# Altium project BalanceCar_PCB.PrjPcb
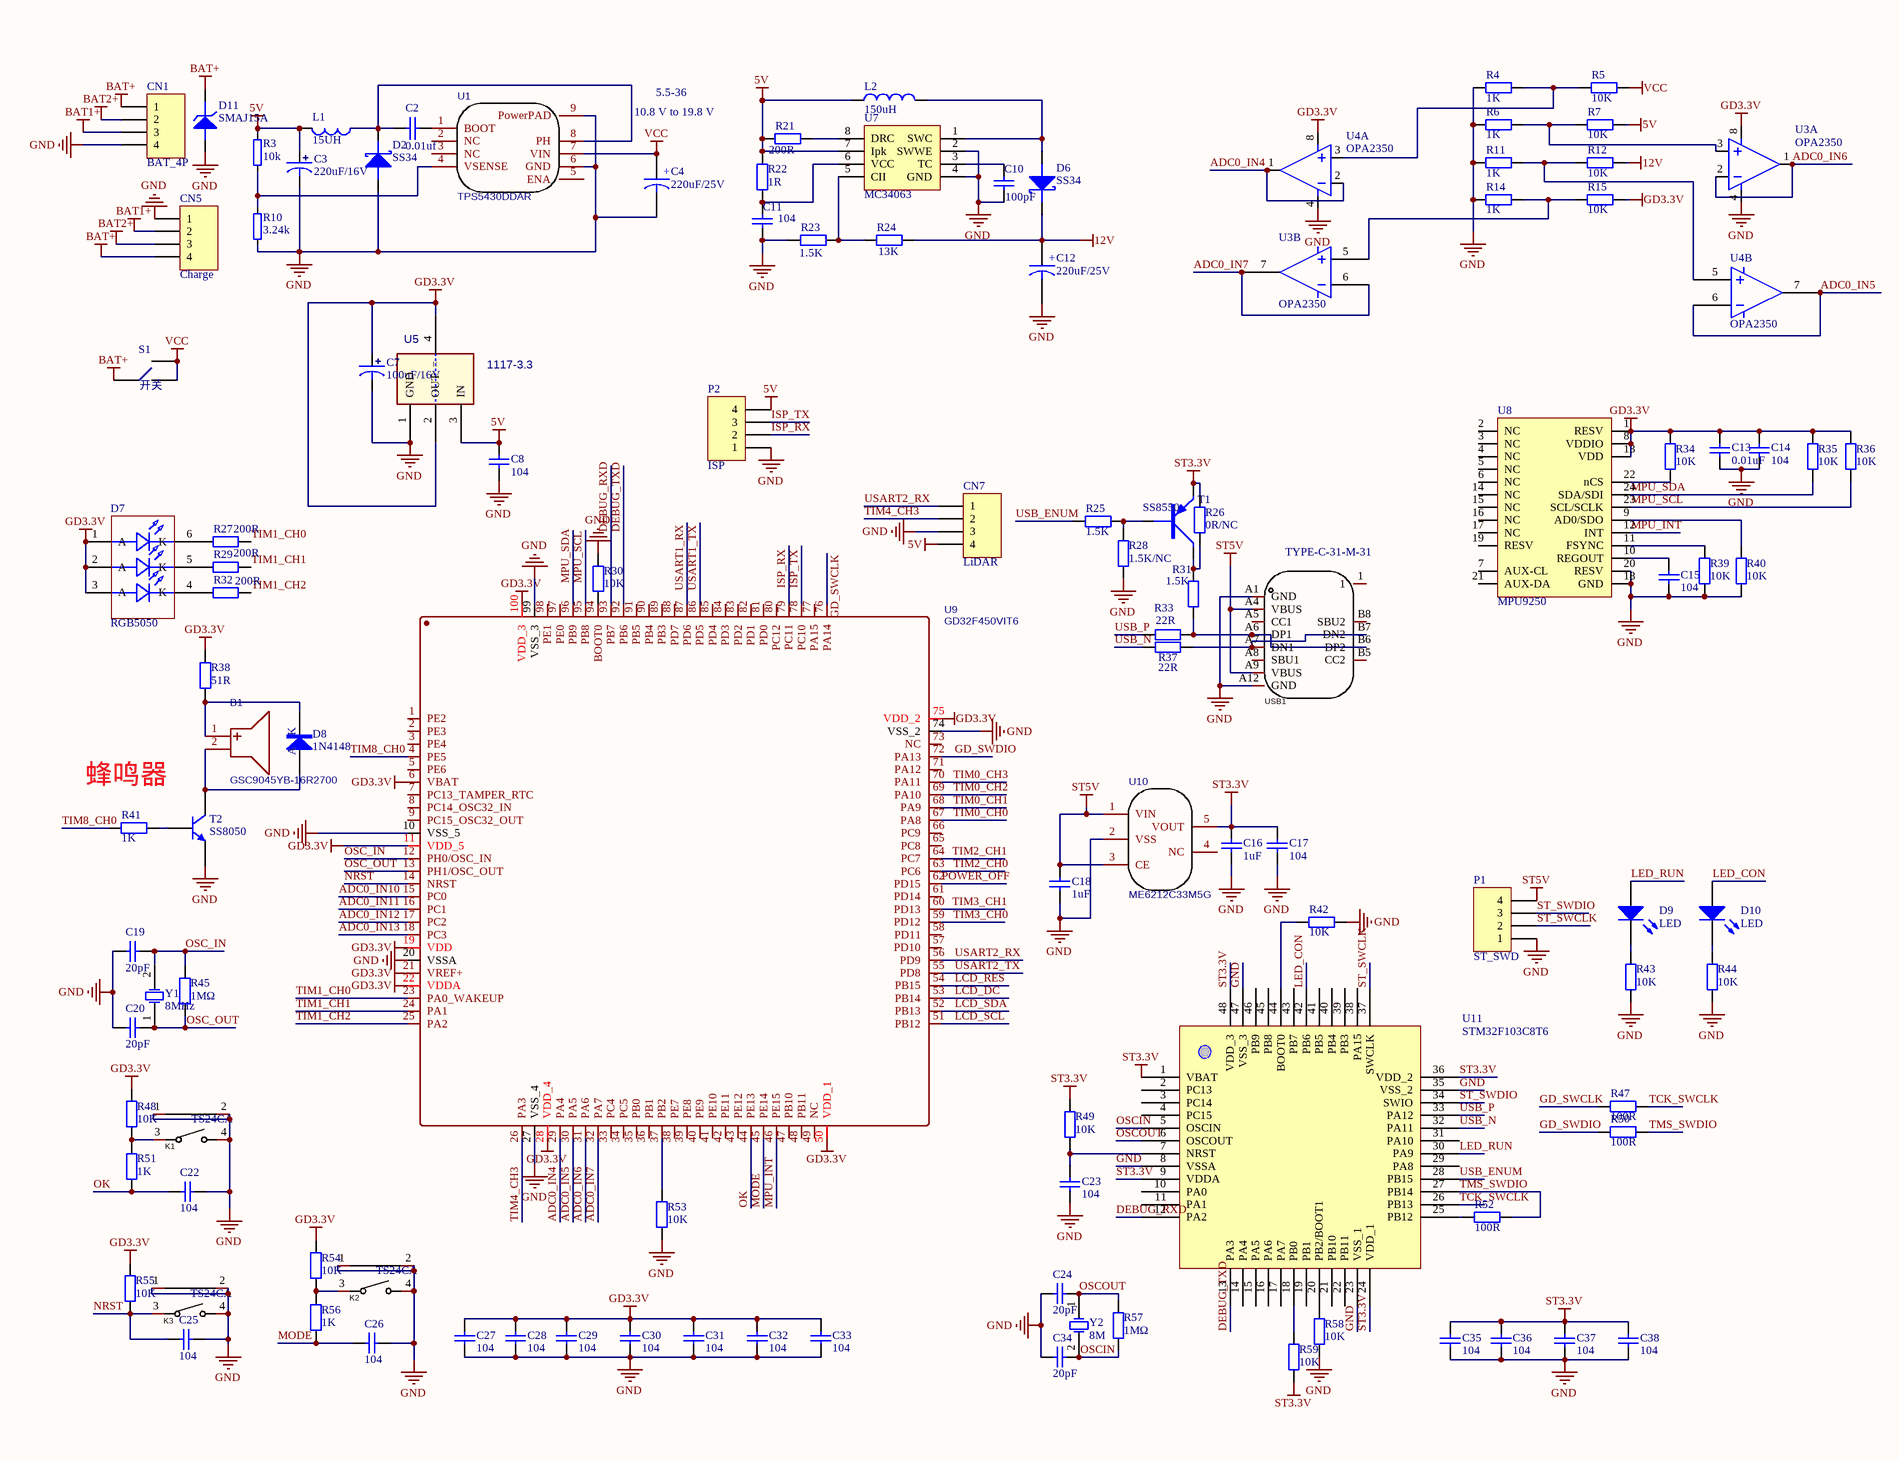
[diagram p0: BalanceCar_sch.SchDoc, left]
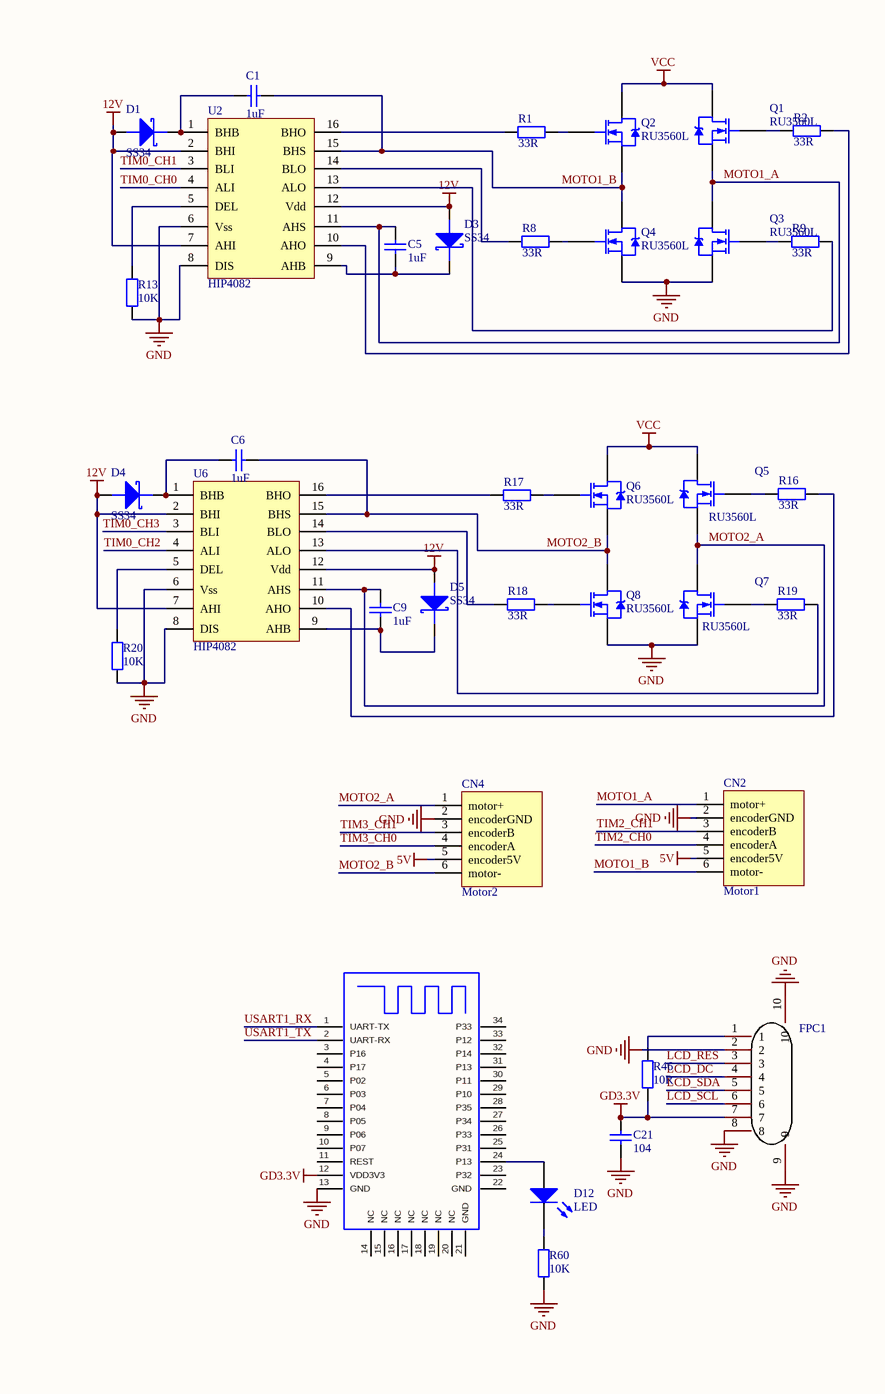
[diagram p1: BalanceCar_sch.SchDoc, right]
1 sheet, 150 parts. Net scope: global (net labels, ports and power ports of the same name join across sheets).
Board file: BalanceCar_pcb.PcbDoc

## Sheet BalanceCar_sch.SchDoc
size A2

### Parts
B1  GSC9045YB-16R2700  [BUZ-SMD_GSC9045YB-16R2700]
C1  1uF  [0603-JLC-C]
C2  0.01uf  [0603-JLC-C]
C3  220uF/16V  [SMD,6.3x5.3mm]
C4  220uF/25V  [SMD,6.3x5.8mm]
C5  1uF  [0603-JLC-C]
C6  1uF  [0603-JLC-C]
C7  100uF/16V  [SMD,6.3x5.3mm]
C8  104  [0603-JLC-C]
C9  1uF  [0603-JLC-C]
C10  100pF  [0603-JLC-C]
C11  104  [0603-JLC-C]
C12  220uF/25V  [SMD,6.3x5.8mm]
C13  0.01uF  [0603-JLC-C]
C14  104  [0603-JLC-C]
C15  104  [0603-JLC-C]
C16  1uF  [0603-JLC-C]
C17  104  [0603-JLC-C]
C18  1uF  [0603-JLC-C]
C19  20pF  [0603-JLC-C]
C20  20pF  [0603-JLC-C]
C21  104  [0603-JLC-C]
C22  104  [0603-JLC-C]
C23  104  [0603-JLC-C]
C24  20pF  [0603-JLC-C]
C25  104  [0603-JLC-C]
C26  104  [0603-JLC-C]
C27  104  [0603-JLC-C]
C28  104  [0603-JLC-C]
C29  104  [0603-JLC-C]
C30  104  [0603-JLC-C]
C31  104  [0603-JLC-C]
C32  104  [0603-JLC-C]
C33  104  [0603-JLC-C]
C34  20pF  [0603-JLC-C]
C35  104  [0603-JLC-C]
C36  104  [0603-JLC-C]
C37  104  [0603-JLC-C]
C38  104  [0603-JLC-C]
CN1  BAT_4P  [CONN-TH_4P-P2.50_HX25003-4A]
CN2  Motor1  [CONN-TH_6P-P2.50_X8821WR-06S-N2SN]
CN4  Motor2  [CONN-TH_6P-P2.50_X8821WR-06S-N2SN]
CN5  Charge  [CONN-TH_4P-P2.54_X8821WR-06S-N2SN]
CN7  LiDAR  [CONN-TH_4P-P2.50_HX25003-4A]
D1  SS34  [SMA(DO-214AC)]
D2  SS34  [SMA(DO-214AC)]
D3  SS34  [SMA(DO-214AC)]
D4  SS34  [SMA(DO-214AC)]
D5  SS34  [SMA(DO-214AC)]
D6  SS34  [SMA(DO-214AC)]
D7  RGB5050  [LED-SMD_6P-L5.0-W5.0-FD]
D8  1N4148  [1206]
D9  LED  [0603LED]
D10  LED  [0603LED]
D11  SMAJ15A  [SMA(DO-214AC)]
D12  LED  [0603LED]
FPC1  AFC24-S08FIC-00  [FPC-SMD_P0.50-8P-QCHF-SM-H2.0]  (value not drawn)
K1  TS24CA  [SW-SMD_TS24CA]
K2  TS24CA  [SW-SMD_TS24CA]
K3  TS24CA  [SW-SMD_TS24CA]
L1  15UH  [IND-SMD_L7.1-W6.6]
L2  150uH  [IND-SMD_L5.0-W5.0_SMNR5040]
P1  ST_SWD  [HDR1X4]
P2  ISP  [HDR1X4]
Q1  RU3560L  [TO-252-3L]
Q2  RU3560L  [TO-252-3L]
Q3  RU3560L  [TO-252-3L]
Q4  RU3560L  [TO-252-3L]
Q5  RU3560L  [TO-252-3L]
Q6  RU3560L  [TO-252-3L]
Q7  RU3560L  [TO-252-3L]
Q8  RU3560L  [TO-252-3L]
R1  33R  [0603-RMOS]
R2  33R  [0603-RMOS]
R3  10k  [0603-JLC-R]
R4  1K  [0603-JLC-R]
R5  10K  [0603-JLC-R]
R6  1K  [0603-JLC-R]
R7  10K  [0603-JLC-R]
R8  33R  [0603-RMOS]
R9  33R  [0603-RMOS]
R10  3.24k  [0603-JLC-R]
R11  1K  [0603-JLC-R]
R12  10K  [0603-JLC-R]
R13  10K  [0603-JLC-R]
R14  1K  [0603-JLC-R]
R15  10K  [0603-JLC-R]
R16  33R  [0603-RMOS]
R17  33R  [0603-RMOS]
R18  33R  [0603-RMOS]
R19  33R  [0603-RMOS]
R20  10K  [0603-JLC-R]
R21  200R  [0603-JLC-R]
R22  1R  [0603-JLC-R]
R23  1.5K  [0603-JLC-R]
R24  13K  [0603-JLC-R]
R25  1.5K  [0603-JLC-R]
R26  0R/NC  [0603-JLC-R]
R27  200R  [0603-JLC-R]
R28  1.5K/NC  [0603-JLC-R]
R29  200R  [0603-JLC-R]
R30  10K  [0603-JLC-R]
R31  1.5K  [0603-JLC-R]
R32  200R  [0603-JLC-R]
R33  22R  [0603-JLC-R]
R34  10K  [0603-JLC-R]
R35  10K  [0603-JLC-R]
R36  10K  [0603-JLC-R]
R37  22R  [0603-JLC-R]
R38  51R  [0603-JLC-R]
R39  10K  [0603-JLC-R]
R40  10K  [0603-JLC-R]
R41  1K  [0603-JLC-R]
R42  10K  [0603-JLC-R]
R43  10K  [0603-JLC-R]
R44  10K  [0603-JLC-R]
R45  1MΩ  [0603-JLC-R]
R46  10R  [0603-JLC-R]
R47  100R  [0603-JLC-R]
R48  10K  [0603-JLC-R]
R49  10K  [0603-JLC-R]
R50  100R  [0603-JLC-R]
R51  1K  [0603-JLC-R]
R52  100R  [0603-JLC-R]
R53  10K  [0603-JLC-R]
R54  10K  [0603-JLC-R]
R55  10K  [0603-JLC-R]
R56  1K  [0603-JLC-R]
R57  1MΩ  [0603-JLC-R]
R58  10K  [0603-JLC-R]
R59  10K  [0603-JLC-R]
R60  10K  [0603-JLC-R]
S1  开关  [拨动电源开关]
T1  SS8550  [SOT-23]
T2  SS8050  [SOT-23]
U1  TPS5430DDAR  [SOIC-8_L5.0-W4.0-P1.27-LS6.0-BL-EP2.0]
U2  HIP4082  [HIP4082b]
U3  OPA2350  [SOP_8]  (parts A,B of 2)
U4  OPA2350  [SOP_8]  (parts A,B of 2)
U5  1117-3.3  [SOT223]
U6  HIP4082  [HIP4082b]
U7  MC34063  [SOP-8_L4.9-W3.9-P1.27-LS6.0-BL]
U8  MPU9250  [QFN24 4x4]
U9  GD32F450VIT6  [LQFP-100_L14.0-W14.0-P0.50-LS16.0-BL]
U10  ME6212C33M5G  [ME6212C33M5G]
U11  STM32F103C8T6  [STM32F103C6T6]
U13  BT04-E01  [BT04-E02]  (value not drawn)
USB1  TYPE-C-31-M-31  [USB-C-SMD_TYPE-C-31-M-31]
Y1  8MHz  [3225]
Y2  8M  [3225]

### Nets
5V: C3.1 C8.2 CN2.5(encoder5V) CN4.5(encoder5V) CN7.4 L1.1 L2.1 P2.4 R3.2 R7.2 R21.1 R22.2 U5.3(IN) U7.7(Ipk)
12V: C12.1 D1.2(A) D3.2(A) D4.2(A) D5.2(A) D6.1(K) R12.2 R24.1 U2.2(BHI) U2.7(AHI) U2.12(Vdd) U6.2(BHI) U6.7(AHI) U6.12(Vdd)
BAT1+: CN1.3 CN5.2
BAT2+: CN1.2 CN5.3
BAT+: CN1.1 CN5.4 D11.1(K) S1.1
GD3.3V: C7.1 C13.2 C14.2 C21.2 C27.2 C28.2 C29.2 C30.2 C31.2 C32.2 C33.2 D7.1(A) D7.2(A) D7.3(A) FPC1.7 R15.2 R34.2 R35.2 R36.2 R38.1 R46.1 R48.2 R54.2 R55.2 U3.8 U4.8 U5.2(OUT) U5.4(=) U8.1(RESV) U8.8(VDDIO) U8.13(VDD) U9.6(VBAT) U9.11(VDD_5) U9.19(VDD) U9.21(VREF+) U9.22(VDDA) U9.28(VDD_4) U9.50(VDD_1) U9.75(VDD_2) U9.100(VDD_3) U13.12(VDD3V3)
GND: C3.2 C4.2 C7.2 C8.1 C10.1 C11.1 C12.2 C13.1 C14.1 C15.1 C16.1 C17.1 C18.1 C19.1 C20.1 C21.1 C22.2 C23.2 C24.1 C25.2 C26.2 C27.1 C28.1 C29.1 C30.1 C31.1 C32.1 C33.1 C34.1 C35.1 C36.1 C37.1 C38.1 CN1.4 CN2.2(encoderGND) CN4.2(encoderGND) CN5.1 CN7.3 D2.2(A) D11.2(A) FPC1.2 FPC1.8 FPC1.9 FPC1.10 K1.1 K1.2 K1.4 K2.1 K2.2 K2.4 K3.1 K3.2 K3.4 P1.1 P2.1 Q3.3(S) Q4.3(S) Q7.3(S) Q8.3(S) R4.1 R6.1 R10.1 R11.1 R13.1 R14.1 R20.1 R23.1 R28.2 R30.1 R39.1 R40.1 R42.2 R43.1 R44.1 R53.2 R58.1 R60.1 T2.2(E) U1.6(GND) U1.9(PowerPAD) U2.6(Vss) U2.8(DIS) U3.4 U4.4 U5.1(GND) U6.6(Vss) U6.8(DIS) U7.2(SWWE) U7.4(GND) U8.18(GND) U8.20(RESV) U9.10(VSS_5) U9.20(VSSA) U9.27(VSS_4) U9.74(VSS_2) U9.99(VSS_3) U10.2(VSS) U11.8(VSSA) U11.23(VSS_1) U11.35(VSS_2) U11.47(VSS_3) U13.13(GND) USB1.A1(GND) USB1.A12(GND)
ST3.3V: C16.2 C17.2 C35.2 C36.2 C37.2 C38.2 R26.1 R49.2 R59.1 T1.2(E) U10.5(VOUT) U11.1(VBAT) U11.9(VDDA) U11.24(VDD_1) U11.36(VDD_2) U11.48(VDD_3)
ST5V: C18.2 P1.4 U10.1(VIN) U10.3(CE) USB1.A4(VBUS) USB1.A9(VBUS)
VCC: C4.1 Q1.2(D) Q2.2(D) Q5.2(D) Q6.2(D) R5.2 S1.2 S1.3 U1.7(VIN)
ADC0_IN4: U4.1 U4.2 U9.29(PA4)
ADC0_IN5: U4.6 U4.7 U9.30(PA5)
ADC0_IN6: U3.1 U3.2 U9.31(PA6)
ADC0_IN7: U3.6 U3.7 U9.32(PA7)
ADC0_IN10: U9.15(PC0)
ADC0_IN11: U9.16(PC1)
ADC0_IN12: U9.17(PC2)
ADC0_IN13: U9.18(PC3)
DEBUG_RXD: U9.93(PB7) U11.12(PA2)
DEBUG_TXD: U9.92(PB6) U11.13(PA3)
GD_SWCLK: R47.1 U9.76(PA14)
GD_SWDIO: R50.1 U9.72(PA13)
ISP_RX: P2.2 U9.79(PC11)
ISP_TX: P2.3 U9.78(PC10)
LCD_DC: FPC1.4 U9.53(PB14)
LCD_RES: FPC1.3 U9.54(PB15)
LCD_SCL: FPC1.6 U9.51(PB12)
LCD_SDA: FPC1.5 U9.52(PB13)
LED_CON: D10.1(A) U11.42(PB6)
LED_RUN: D9.1(A) U11.30(PA9)
MODE: C26.1 R56.2 U9.45(PE14)
MOTO1_A: C5.2 CN2.1(motor+) Q1.3(S) Q3.2(D) U2.11(AHS)
MOTO1_B: C1.2 CN2.6(motor-) Q2.3(S) Q4.2(D) U2.15(BHS)
MOTO2_A: C9.2 CN4.1(motor+) Q5.3(S) Q7.2(D) U6.11(AHS)
MOTO2_B: C6.2 CN4.6(motor-) Q6.3(S) Q8.2(D) U6.15(BHS)
MPU_INT: U8.12(INT) U9.46(PE15)
MPU_SCL: R36.1 U8.23(SCL/SCLK) U9.95(PB8)
MPU_SDA: R35.1 U8.24(SDA/SDI) U9.96(PB9)
NRST: C25.1 K3.3 R55.1 U9.14(NRST)
OK: C22.1 R51.2 U9.44(PE13)
OSC_IN: C19.2 R45.2 U9.12(PH0/OSC_IN) Y1.2(OSC2)
OSC_OUT: C20.2 R45.1 U9.13(PH1/OSC_OUT) Y1.1(OSC1)
OSCIN: C34.2 R57.1 U11.5(OSCIN) Y2.2
OSCOUT: C24.2 R57.2 U11.6(OSCOUT) Y2.1
POWER_OFF: U9.62(PD15)
ST_SWCLK: P1.2 U11.37(SWCLK)
ST_SWDIO: P1.3 U11.34(SWIO)
TCK_SWCLK: R47.2 U11.26(PB13)
TIM0_CH0: U2.4(ALI) U9.67(PA8)
TIM0_CH1: U2.3(BLI) U9.68(PA9)
TIM0_CH2: U6.4(ALI) U9.69(PA10)
TIM0_CH3: U6.3(BLI) U9.70(PA11)
TIM1_CH0: R27.1 U9.23(PA0_WAKEUP)
TIM1_CH1: R29.1 U9.24(PA1)
TIM1_CH2: R32.1 U9.25(PA2)
TIM2_CH0: CN2.4(encoderA) U9.63(PC6)
TIM2_CH1: CN2.3(encoderB) U9.64(PC7)
TIM3_CH0: CN4.4(encoderA) U9.59(PD12)
TIM3_CH1: CN4.3(encoderB) U9.60(PD13)
TIM4_CH3: CN7.2 U9.26(PA3)
TIM8_CH0: R41.1 U9.4(PE5)
TMS_SWDIO: R50.2 R52.2 U11.27(PB14)
USART1_RX: U9.87(PD6) U13.1(UART-TX)
USART1_TX: U9.86(PD5) U13.2(UART-RX)
USART2_RX: CN7.1 U9.56(PD9)
USART2_TX: U9.55(PD8)
USB_ENUM: R25.2 U11.28(PB15)
USB_N: R37.2 U11.32(PA11)
USB_P: R33.2 U11.33(PA12)
NetB1_1: B1.1(+) D8.2(K) R38.2
NetB1_2: B1.2(-) D8.1 T2.3(C)
NetC1_1: C1.1 D1.1(K) U2.1(BHB)
NetC2_1: C2.1 D2.1(K) L1.2 U1.8(PH)
NetC2_2: C2.2 U1.1(BOOT)
NetC5_1: C5.1 D3.1(K) U2.9(AHB)
NetC6_1: C6.1 D4.1(K) U6.1(BHB)
NetC9_1: C9.1 D5.1(K) U6.9(AHB)
NetC10_2: C10.2 U7.3(TC)
NetC11_2: C11.2 R22.1 U7.6(VCC)
NetC15_2: C15.2 U8.10(REGOUT)
NetC23_1: C23.1 R49.1 U11.7(NRST)
NetD6_2: D6.2(A) L2.2 U7.1(SWC)
NetD7_4: D7.4(K) R32.2
NetD7_5: D7.5(K) R29.2
NetD7_6: D7.6(K) R27.2
NetD9_2: D9.2(K) R43.2
NetD10_2: D10.2(K) R44.2
NetD12_1: D12.1(A) U13.24(P13)
NetD12_2: D12.2(K) R60.2
NetFPC1_1: FPC1.1 R46.2
NetK1_3: K1.3 R48.1 R51.1
NetK2_3: K2.3 R54.1 R56.1
NetQ1_1: Q1.1(G) R2.2
NetQ2_1: Q2.1(G) R1.1
NetQ3_1: Q3.1(G) R9.2
NetQ4_1: Q4.1(G) R8.1
NetQ5_1: Q5.1(G) R16.2
NetQ6_1: Q6.1(G) R17.1
NetQ7_1: Q7.1(G) R19.2
NetQ8_1: Q8.1(G) R18.1
NetR1_2: R1.2 U2.16(BHO)
NetR2_1: R2.1 U2.10(AHO)
NetR3_1: R3.1 R10.2 U1.4(VSENSE)
NetR4_2: R4.2 R5.1 U4.3
NetR6_2: R6.2 R7.1 U3.3
NetR8_2: R8.2 U2.14(BLO)
NetR9_1: R9.1 U2.13(ALO)
NetR11_2: R11.2 R12.1 U4.5
NetR13_2: R13.2 U2.5(DEL)
NetR14_2: R14.2 R15.1 U3.5
NetR16_1: R16.1 U6.10(AHO)
NetR17_2: R17.2 U6.16(BHO)
NetR18_2: R18.2 U6.14(BLO)
NetR19_1: R19.1 U6.13(ALO)
NetR20_2: R20.2 U6.5(DEL)
NetR21_2: R21.2 U7.8(DRC)
NetR23_2: R23.2 R24.2 U7.5(CII)
NetR25_1: R25.1 R28.1 T1.1(B)
NetR26_2: R26.2 R31.1 T1.3(C)
NetR30_2: R30.2 U9.94(BOOT0)
NetR31_2: R31.2 R33.1 USB1.A6(DP1) USB1.B6(DP2)
NetR34_1: R34.1 U8.22(nCS)
NetR37_1: R37.1 USB1.A7(DN1) USB1.B7(DN2)
NetR39_2: R39.2 U8.11(FSYNC)
NetR40_2: R40.2 U8.9(AD0/SDO)
NetR41_2: R41.2 T2.1(B)
NetR42_1: R42.1 U11.44(BOOT0)
NetR52_1: R52.1 U11.25(PB12)
NetR53_1: R53.1 U9.37(PB2)
NetR58_2: R58.2 U11.20(PB2/BOOT1)
NetR59_2: R59.2 U11.18(PB0)

Not connected (* = marked no-connect by the designer): U1 2(NC) 3(NC) 5(ENA); U8 2(NC) 3(NC) 4(NC) 5(NC) 6(NC) 7(AUX-CL) 14(NC) 15(NC) 16(NC) 17(NC) 19(RESV) 21(AUX-DA); U9 1(PE2) 2(PE3) 3(PE4) 5(PE6) 7(PC13_TAMPER_RTC) 8(PC14_OSC32_IN) 9(PC15_OSC32_OUT) 33(PC4) 34(PC5) 35(PB0) 36(PB1) 38(PE7) 39(PE8) 40(PE9) 41(PE10) 42(PE11) 43(PE12) 47(PB10) 48(PB11) 49(NC) 57(PD10) 58(PD11) 61(PD14) 65(PC8) 66(PC9) 71(PA12) 73(NC) 77(PA15) 80(PC12) 81(PD0) 82(PD1) 83(PD2) 84(PD3) 85(PD4) 88(PD7) 89(PB3) 90(PB4) 91(PB5) 97(PE0) 98(PE1); U10 4(NC); U11 2(PC13) 3(PC14) 4(PC15) 10(PA0) 11(PA1) 14(PA4) 15(PA5) 16(PA6) 17(PA7) 19(PB1) 21(PB10) 22(PB11) 29(PA8) 31(PA10) 38(PA15) 39(PB3) 40(PB4) 41(PB5) 43(PB7) 45(PB8) 46(PB9); U13 3(P16) 4(P17) 5(P02) 6(P03) 7(P04) 8(P05) 9(P06) 10(P07) 11(REST) 14(NC) 15(NC) 16(NC) 17(NC) 18(NC) 19(NC) 20(NC) 21(GND) 22(GND) 23(P32) 25(P31) 26(P33) 27(P34) 28(P35) 29(P10) 30(P11) 31(P13) 32(P14) 33(P12) 34(P33); USB1 1 A5(CC1) A8(SBU1) B5(CC2) B8(SBU2)

### Notes on the sheet
- 5.5-36
- 10.8 V to 19.8 V
- (near R41) 蜂鸣器
- Title
- Size:
- Date:
- File:
- A2
- Number:
- Time:
- Revision:
- Sheet
- of
- (in symbol CAP极性) +
- (in symbol DIODE) A

### Library data of the parts
B1 = GSC9045YB-16R2700: 无源蜂鸣器; BOM_Manufacturer: INGHAi; Contributor: LCSC; Frequency: 2700Hz; BOM_Supplier: LCSC; BOM_Supplier Part: C255324; BOM_Manufacturer Part: GSC9045YB-16R2700; BOM_JLCPCB Part Class: Extended Part; spicePre: B; spiceSymbolName: GSC9045YB-16R2700
C1 C5 C6 C9 C13-C23 C25-C33 C35-C38 = Cap: C0603; Value: 100pF; Published: 8-Jun-2000; LatestRevisionDate: 17-Jul-2002; LatestRevisionNote: Re-released for DXP Platform.; PackageReference: RAD-0.3; Publisher: Altium Limited; PackageDescription: Radial Cap, Thru-Hole; 2 Leads; 0.3 in Pin Spacing
C2 = 普通电容: C0603
C3 C7 = SMD_ECAP: 6.3*5.3mm铝电解电容
C4 C12 = CAP极性: 贴片铝电解电容SMD,6.3x5.8mm
C8 = Cap: C0603; Value: 0.1uf; Published: 8-Jun-2000; LatestRevisionDate: 17-Jul-2002; LatestRevisionNote: Re-released for DXP Platform.; PackageReference: RAD-0.3; Publisher: Altium Limited; PackageDescription: Radial Cap, Thru-Hole; 2 Leads; 0.3 in Pin Spacing
C10 C11 = CAP_0805: Value: 470pF
C24 C34 = Cap: C0603; Value: 104; Published: 8-Jun-2000; LatestRevisionDate: 17-Jul-2002; LatestRevisionNote: Re-released for DXP Platform.; Publisher: Altium Limited
CN1 CN5 CN7 = Header 4: 卧式XH2.54 4P; LatestRevisionDate: 17-Jul-2002; LatestRevisionNote: Re-released for DXP Platform.; Publisher: Altium Limited
CN2 CN4 = Motor: 卧式XH2.54 6P
D1-D6 = DIODE SCHOTTKY: 肖特基二极管
D7 = RGB5050: 5050灯珠
D8 = DIODE
D9 D10 D12 = LED3: 0603白色LED; Published: 8-Jun-2000; LatestRevisionDate: 17-Dec-2003; LatestRevisionNote: PCB Footprint replaced.; DatasheetVersion: 16-Apr-2002; PackageVersion: 16-Apr-2002; PackageReference: 3.5X2.8X1.9; Publisher: Altium Limited; PackageDescription: SM LED; 2 C-Bend Leads; Body 3.5 x 2.8 x 1.9 mm, inc leads (LxWxH typ)
D11 = DIODE ZENER: 单向TVS管
FPC1 = AFC24-S08FIC-00: 间距:0.5mm;触点数量:8;锁定特性:翻盖式;安装类型:卧贴;触点类型:双侧触点/上下接;; Manufacturer: JS(钜硕电子); Add into BOM: yes; Pitch: 0.5mm; Number of Contacts: 8; Locking Feature: 翻盖式; FFC, FCB Thickness: 0.3mm; Name: AFC24-S08FIC-00; Symbol: AFC24-S08FIC-00; Device: AFC24-S08FIC-00; LCSC Part Name: 0.5mm P数:8 翻盖式 双侧触点/上下接 前插后翻 镀金; Supplier Part: C262288; Manufacturer Part: AFC24-S08FIC-00; Supplier Footprint: SMD,P=0.5mm; JLCPCB Part Class: Extended Part; Datasheet: https://atta.szlcsc.com/upload/public/pdf/source/20180814/C262288_3EA2E7FD5EA0EEBDC908165C192842F4.pdf; Supplier: LCSC; Convert to PCB: yes; Mounting Type: 卧贴; Contact Type: 双侧触点/上下接; Height Above Board: 2mm
K1-K3 = TS24CA: Manufacturer: SHOU HAN(首韩); Add into BOM: yes; Contact Current: 50mA; Voltage Rating (DC): 12V; Circuit: 单刀单掷; Actuator Style: 矩形按钮; Switch Length: 4.55mm; Switch Width: 1.8mm; Switch Height: 3.5mm; Name: TS24CA; Symbol: TS24CA; Device: TS24CA; LCSC Part Name: 2*4*3.5半包小贝贝TS-018小侧按键m165蓝牙耳机轻触开关; Supplier Part: C393942; Manufacturer Part: TS24CA; Supplier Footprint: SMD; JLCPCB Part Class: Extended Part; Datasheet: https://atta.szlcsc.com/upload/public/pdf/source/20190521/C393942_591A9E318887EFA4274D34029981AD99.pdf; Supplier: LCSC; Convert to PCB: yes; Mounting Style: 卧贴; With Lamp: -
L1 = L: 一体成型功率电感
L2 = Inductor: Code_IEC: 1005; Value: 100uH; Published: 8-Jun-2000; LatestRevisionDate: 17-Jul-2002; LatestRevisionNote: Re-released for DXP Platform.; PackageReference: 0402-A; Publisher: Altium Limited; Code_JEITA: 0402
P1 P2 = Header 4: Header, 4-Pin; LatestRevisionDate: 17-Jul-2002; LatestRevisionNote: Re-released for DXP Platform.; Publisher: Altium Limited
Q1-Q8 = IRFR1205: NMOSFET; Manufacturer: International Rectifier; Class I: Discrete; Class II: MOSFET - Power; Note: Pin 2 is trimmed and is electrically connected to Drain.; Published: 8-Jun-2000; Revision: July-2002: Re-released for DXP Platform.; Datasheet: Latest Revision: PD-91318B; Package Reference: TO-252AA; Publisher: Altium Limited
R1 R2 R5 R7-R9 R12 R13 R15-R20 R27 R29 R30 R32 R38 R45 R48 R53-R55 = Res2: R0603; Value: 1K; Published: 8-Jun-2000; LatestRevisionDate: 17-Jul-2002; LatestRevisionNote: Re-released for DXP Platform.; PackageReference: AXIAL-0.4; Publisher: Altium Limited; PackageDescription: Axial Device, Thru-Hole; 2 Leads; 0.4 in Pin Spacing
R3 R10 = RES: R0603
R4 R6 R11 R14 R25 R26 R28 R31 R33-R37 R39-R44 R46 R47 R49-R52 R56-R60 = Res2: R0603; Published: 8-Jun-2000; LatestRevisionDate: 17-Jul-2002; LatestRevisionNote: Re-released for DXP Platform.; Publisher: Altium Limited
  R4 R6 R11 R14 R41 R51 R56: PackageReference: AXIAL-0.4; PackageDescription: Axial Device, Thru-Hole; 2 Leads; 0.4 in Pin Spacing; Value: 1K
R21 R22 = RES2_0805: Value: 181
R23 = RES2_0805: Value: 1k
R24 = RES2_0805: Value: 10k
S1 = slide_switch
T1 = PNP: PNP三极管
T2 = 2N3904: NPN三极管
U1 = TPS5430DDAR: DCDC降压芯片; BOM_Manufacturer: TI; BOM_Supplier: LCSC; BOM_Manufacturer Part: TPS5430DDAR; BOM_Supplier Part: C9864; BOM_JLCPCB Part Class: Basic Part; spicePre: U; spiceSymbolName: TPS5430DDAR
U2 U6 = HIP4082: H桥驱动芯片
U3 U4 = OPA2350: 两路运放芯片
U5 = 1117-3.3: 线性稳压3.3V
U9 = GD32F450VIT6: 单片机; BOM_Manufacturer: GigaDevice; BOM_Supplier: LCSC; BOM_Manufacturer Part: GD32F450VIT6; BOM_Supplier Part: C98441; BOM_JLCPCB Part Class: Extended Part; spicePre: U; spiceSymbolName: GD32F450VIT6
U10 = ME6212C33M5G: 线性稳压3.3V; BOM_Manufacturer: MICRONE; BOM_Supplier: LCSC; BOM_Manufacturer Part: ME6212C33M5G; BOM_Supplier Part: C81233; BOM_JLCPCB Part Class: Extended Part; spicePre: U; spiceSymbolName: ME6212C33M5G
U11 = STM32F103C8T6: 单片机
USB1 = TYPE-C-31-M-31: Manufacturer: 韩国韩荣; Add into BOM: yes; Connector Type: Type-C; Gender: 母座; Number of Contacts: 16; Number of Ports: 1; Current Rating - Power (Max): 5A; Name: TYPE-C-31-M-31; Symbol: TYPE-C-31-M-31; Device: TYPE-C-31-M-31; LCSC Part Name: Type-C 母座 卧贴; Supplier Part: C2760486; Manufacturer Part: TYPE-C-31-M-31; Supplier Footprint: SMD; JLCPCB Part Class: Extended Part; Datasheet: https://atta.szlcsc.com/upload/public/pdf/source/20210118/C2682493_F440440370DF84A0F7EEFA980F9F119A.pdf; Supplier: LCSC; Convert to PCB: yes; Standard: -; Mounting Style: 卧贴; Operating Temperature Range: -30℃~+80℃
Y1 Y2 = XTAL: 贴片无源晶振; Published: 8-Jun-2000; LatestRevisionDate: 17-Jul-2002; LatestRevisionNote: Re-released for DXP Platform.; Publisher: Altium Limited
  Y1: PackageReference: R38; PackageDescription: Crystal, Thru-Hole; 2 Leads; Body 3.1 x 8.2 mm (Dia.xH)